# EAGLE design usbB_isp (EAGLE 6.4)
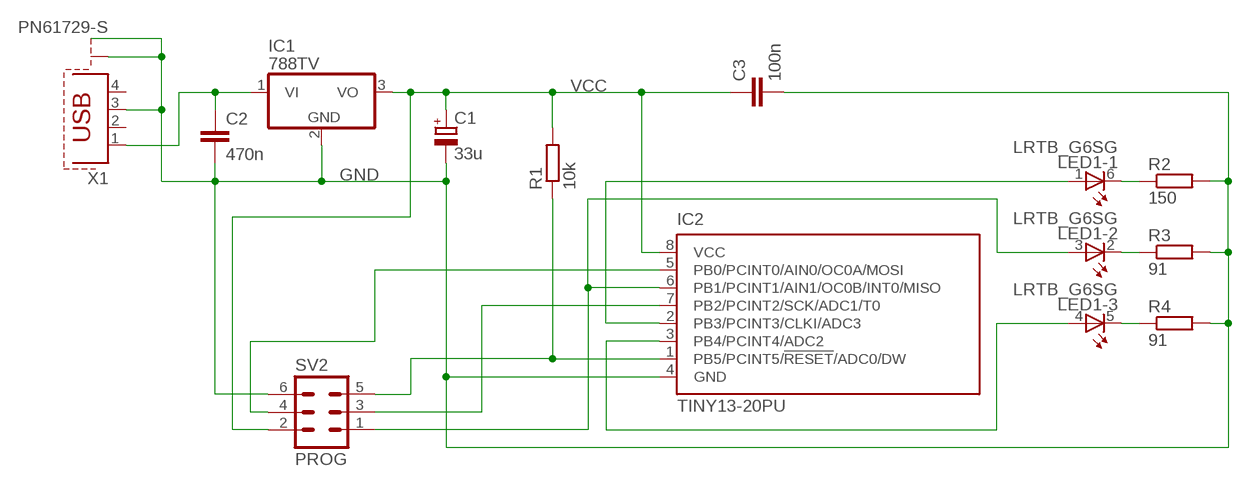
[diagram p0: schematic, sheet 1]

## Parts
C1  33u  CPOL-EUE2,5-6E  [E2,5-6E]
C2  470n  C-EU050-025X075  [C050-025X075]
C3  100n  C-EU050-025X075  [C050-025X075]
IC1  788TV  [TO220V]
IC2  TINY13-20PU  [DIL08]
LED1  LRTB_G6SG  [LRTB_G6SG]
R1  10k  R-EU_0204/7  [0204/7]
R2  150  R-EU_0204/7  [0204/7]
R3  91  R-EU_0204/7  [0204/7]
R4  91  R-EU_0204/7  [0204/7]
SV2  PROG  ML6  [ML6]
X1  PN61729-S  [PN61729-S]

## Nets
_RESET: IC2.1(PB5/PCINT5/!RESET!/ADC0/DW) R1.1 SV2.5
GND: C1.- C2.2 C3.2 IC1.2(GND) IC2.4(GND) R2.2 R3.2 R4.2 SV2.6 X1.3 X1.S1
MISO: IC2.6(PB1/PCINT1/AIN1/OC0B/INT0/MISO) LED1.3(-2:A) SV2.1
N$1: C2.1 IC1.1(VI) X1.1
N$3: IC2.2(PB3/PCINT3/CLKI/ADC3) LED1.1(-1:A)
N$6: LED1.5(-3:C) R4.1
N$7: LED1.2(-2:C) R3.1
N$8: LED1.6(-1:C) R2.1
N$9: IC2.3(PB4/PCINT4/ADC2) LED1.4(-3:A)
N$10: IC2.5(PB0/PCINT0/AIN0/OC0A/MOSI) SV2.4
SCK: IC2.7(PB2/PCINT2/SCK/ADC1/T0) SV2.3
VCC: C1.+ C3.1 IC1.3(VO) IC2.8(VCC) R1.2 SV2.2
Unconnected: X1.2 X1.4 X1.S2

## Library data of the parts
C1 = rcl:CPOL-EU: POLARIZED CAPACITOR, European symbol
C2 C3 = rcl:C-EU: CAPACITOR, European symbol
IC1 = linear:78*: Positive VOLTAGE REGULATOR Source: http://cache.national.com/ds/LM/LM78L05.pdf http://www.fairchildsemi.com/ds/LM/LM7805.pdf
IC2 = atmel:TINY13: 8-bit AVR Microcontroller with 1K Bytes In-System Programmable Flash Source: http://www.atmel.com/dyn/resources/prod_documents/2535S.pdf; MPN: ATTINY13-20PU; OC_FARNELL: 9171550; OC_NEWARK: 96K6521
LED1 = led:LRTB_G6SG: LRTB G6SG 6-lead TOPLED® Source: OSRAM Opto Semiconductors ... LRTB_G6SG_Pb_free.pdf
R1-R4 = resistor:R-EU_: RESISTOR, European symbol
SV2 = con-ml:ML6: HARTING; OC_FARNELL: unknown; OC_NEWARK: unknown
X1 = con-berg:PN61729-S: BERG USB connector; OC_FARNELL: unknown; OC_NEWARK: unknown

## Net classes
0 default: clearance 0.355 mm

## Board
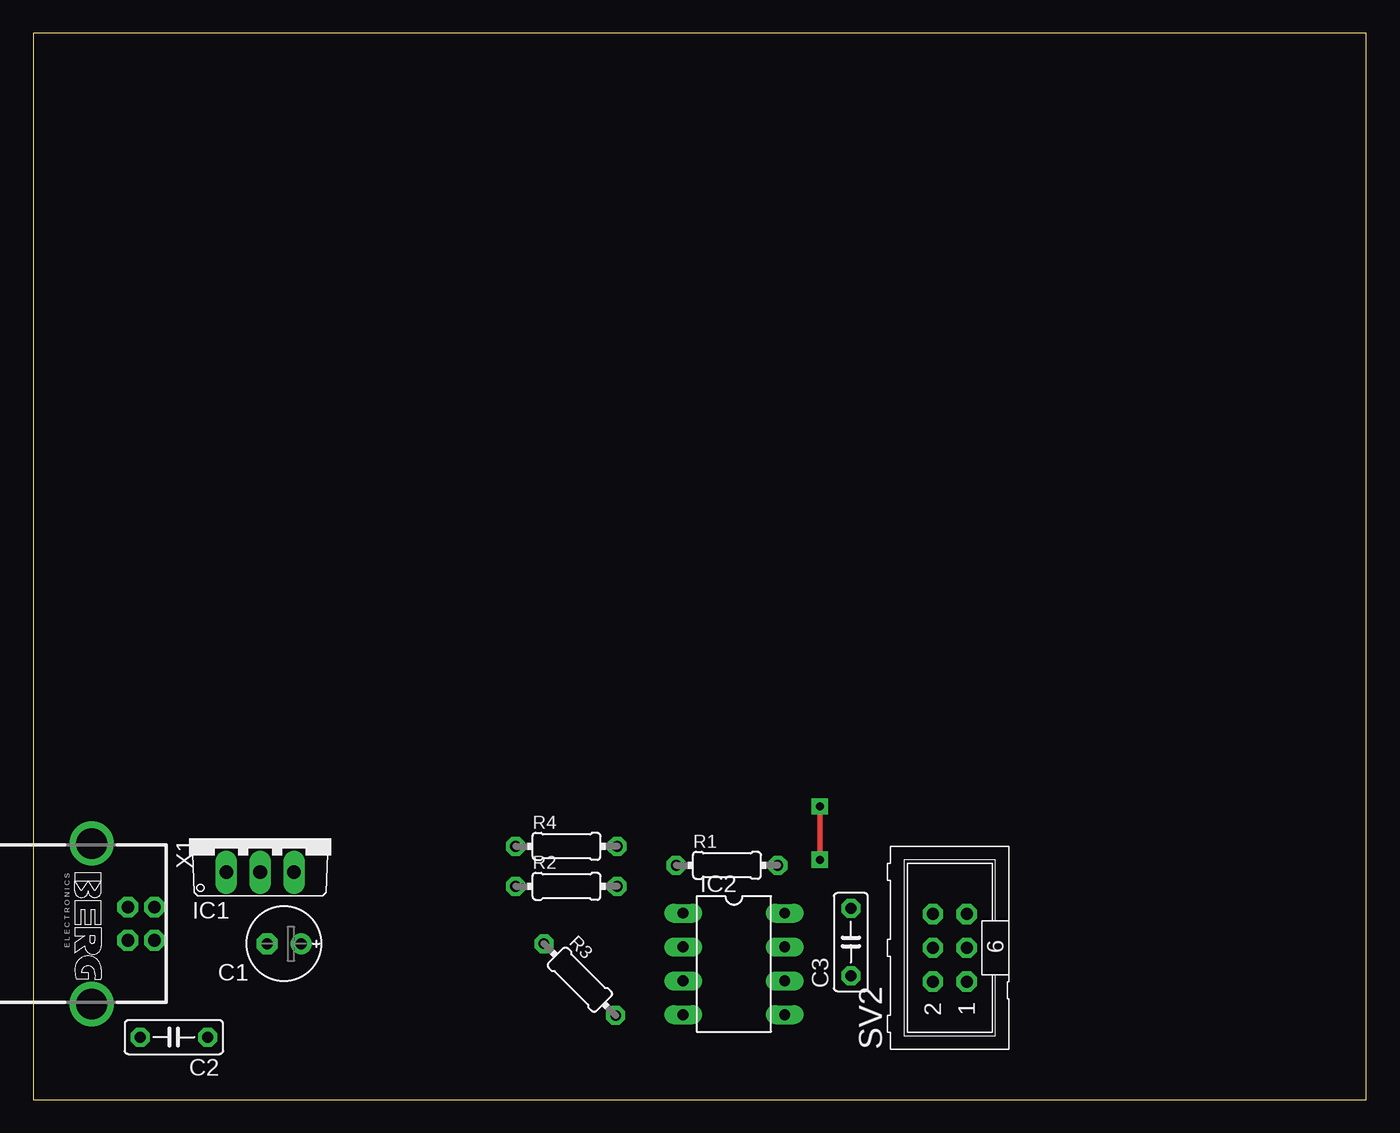
[diagram p1: board, top side]
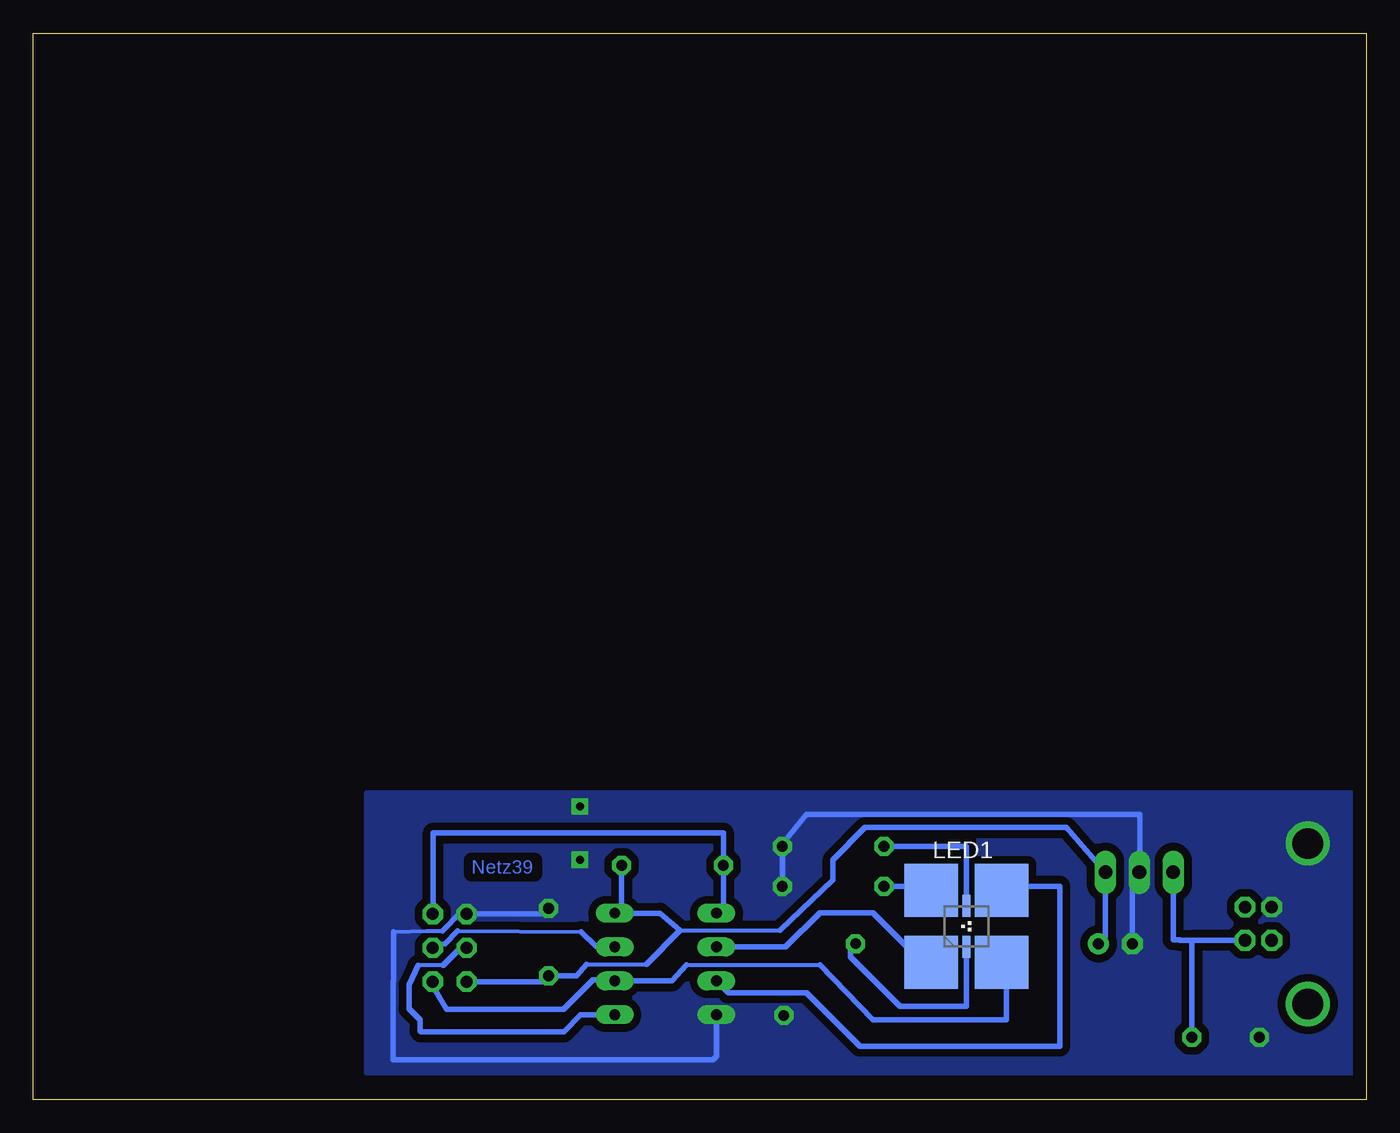
[diagram p2: board, bottom side, seen from below]

Size 100 x 80 mm. Coordinates in mm from the lower left corner, seen from the top.
Outline: 0,0 100,0 100,80 0,80 0,0
Copper layers (1*16): Top 0.035mm / dielectric 1.5mm / Bottom 0.035mm
Design rules "default *": minimum track width 12mil, minimum drill 24mil, track to track 12mil, track to pad 12mil, pad to pad 12mil, via to via 12mil, smd to smd 12mil, copper to edge 40mil, drill to drill 8mil, minimum pad ring 12mil, minimum via ring 12mil, stop-mask expansion 4mil, vias tented up to drill 0mil, thermal gap 10mil

### Footprints (pad centres in the part's own frame; a part is rotated, then mirrored left to right if it is on the bottom)
E2,5-6E = drill 0.813 pad 1.575: + -1.27,0 | drill 0.813 pad 1.575 octagon: - 1.27,0
C050-025X075 = drill 0.813 octagon: 1 -2.54,0; 2 2.54,0
TO220V = drill 1.016 long: 1 -2.54,-2.54; 2 0,-2.54; 3 2.54,-2.54
DIL08 = drill 0.813 long: 1 -3.81,-3.81; 2 -1.27,-3.81; 3 1.27,-3.81; 4 3.81,-3.81; 5 3.81,3.81; 6 1.27,3.81; 7 -1.27,3.81; 8 -3.81,3.81
LRTB_G6SG = smd 4 x 4: 1 -2.65,-2.7; 3 2.65,-2.7; 4 2.65,2.7; 6 -2.65,2.7 | smd 0.6 x 1.65: 2 0,-1.525; 5 0,1.525
0204/7 = drill 0.813 octagon: 1 -3.81,0; 2 3.81,0
ML6 = drill 0.914 octagon: 1 -2.54,-1.27; 2 -2.54,1.27; 3 0,-1.27; 4 0,1.27; 5 2.54,-1.27; 6 2.54,1.27
PN61729-S = drill 0.95 octagon: 1 1.25,4.71; 2 -1.25,4.71; 3 -1.25,2.71; 4 1.25,2.71 | drill 2.3 pad 2.9: S1 -6.02,0; S2 6.02,0

### Placement (x,y rotation side)
C1  18.81,11.68 180 top
C2  10.55,4.68 180 top
C3  61.34,11.81 90 top
IC1  17.02,19.59 0 top
IC2  52.57,10.18 270 top
LED1  30,13 0 bottom
R1  52.04,17.57 0 top
R2  40,16 0 top
R3  41,9 315 top
R4  40,19 0 top
SV2  68.77,11.38 90 top
X1  4.38,13.19 270 top

### Tracks (layer width: path | path; a pad name or v marks a point on that pad's centre or on a via)
_RESET
  Bottom 0.406: IC2.1 48.23,14.51 R1.1 48.23,20 70,20 70,13.96 SV2.5
GND  (via drill 0.6)
  Top 0.406: v59,22 v59,18
  Bottom 0.305: 69.3,12.65 70.47,12.65 72.98,12.6
  Bottom 0.406: 69.3,12.65 67.98,13.99 SV2.6 61.77,13.92 C3.2 | 72.98,12.6 72.98,8.89 73,8.87 73,3 49,3 48.76,3.24 IC2.4 | C1.- 17.54,16.53 IC1.2 17,17.07 17,21.41 42,21.41 43.81,19.19 R2.2 R4.2
  pour Bottom (isolate 0.584, no thermals): 1,23 75,23 75,2 1,2
MISO
  Bottom 0.305: 51,10.1 41,10.1
  Bottom 0.406: SV2.1 70.04,8.54 69,6.76 60.21,6.76 58,9 56.47,9 IC2.6 52.09,8.91 51,10.1 | 41,10.1 37,6 27,6 27,10 27.05,10 LED1.3
N$1
  Bottom 0.406: X1.1 13.09,11.94 | IC1.1 14.48,12 14,12 14,11.94 13.09,11.94 | 13.09,11.94 C2.1
N$3
  Bottom 0.406: IC2.2 43.55,11.45 41,14 37,14 34,11 33,11 32,10 32.35,10 LED1.1
N$6
  Bottom 0.406: R4.1 30,19 LED1.5
N$7
  Bottom 0.406: R3.1 38.69,11.69 38.69,10.69 35,7 30,7 LED1.2
N$8
  Bottom 0.406: 33,16 33,17 32.65,16.65 LED1.6 32.95,16 R2.1
N$9
  Bottom 0.406: 26,16 23,16 23,4 38,4 42,8 47.85,8 IC2.3 | 26,16 28,16 | LED1.4 26.3,15.7 26,16
N$10
  Bottom 0.305: 69.27,10.06 71.14,10.06
  Bottom 0.406: 71.14,10.06 71.81,8.59 71.81,6.81 71,6 71,5.16 70.92,5.08 60.2,5.08 58.93,6.35 56.39,6.35 IC2.5 | 69.27,10.06 67.9,11.43 SV2.4
SCK
  Bottom 0.305: 68.15,12.65 58.9,12.6
  Bottom 0.406: SV2.3 70.04,11.46 70,11.5 69.1,11.7 68.15,12.65 | 58.9,12.6 57.8,11.5 56.43,11.5 IC2.7
VCC
  Bottom 0.305: 51.5,12.7 44,12.7 | 58.5,10.15 54,10.15
  Bottom 0.406: C1.+ 19.56,12.21 IC1.3 22.51,20.41 37.59,20.41 40,18 40,16.5 44,12.7 | SV2.2 61.77,8.84 C3.1 59.23,9.27 58.5,10.15 | 54,10.15 51.5,12.7 52.99,13.99 IC2.8 55.85,14.51 R1.2

### Text on the board
Bottom: Netz39